# EasyEDA schematic SCH_TESIS_2025-09-22.json
TITLE: Sheet_1; REV: 1.0; Date: 2025-09-09; Sheet: 1/1; Drawn By: a20195821; Company: Your Company
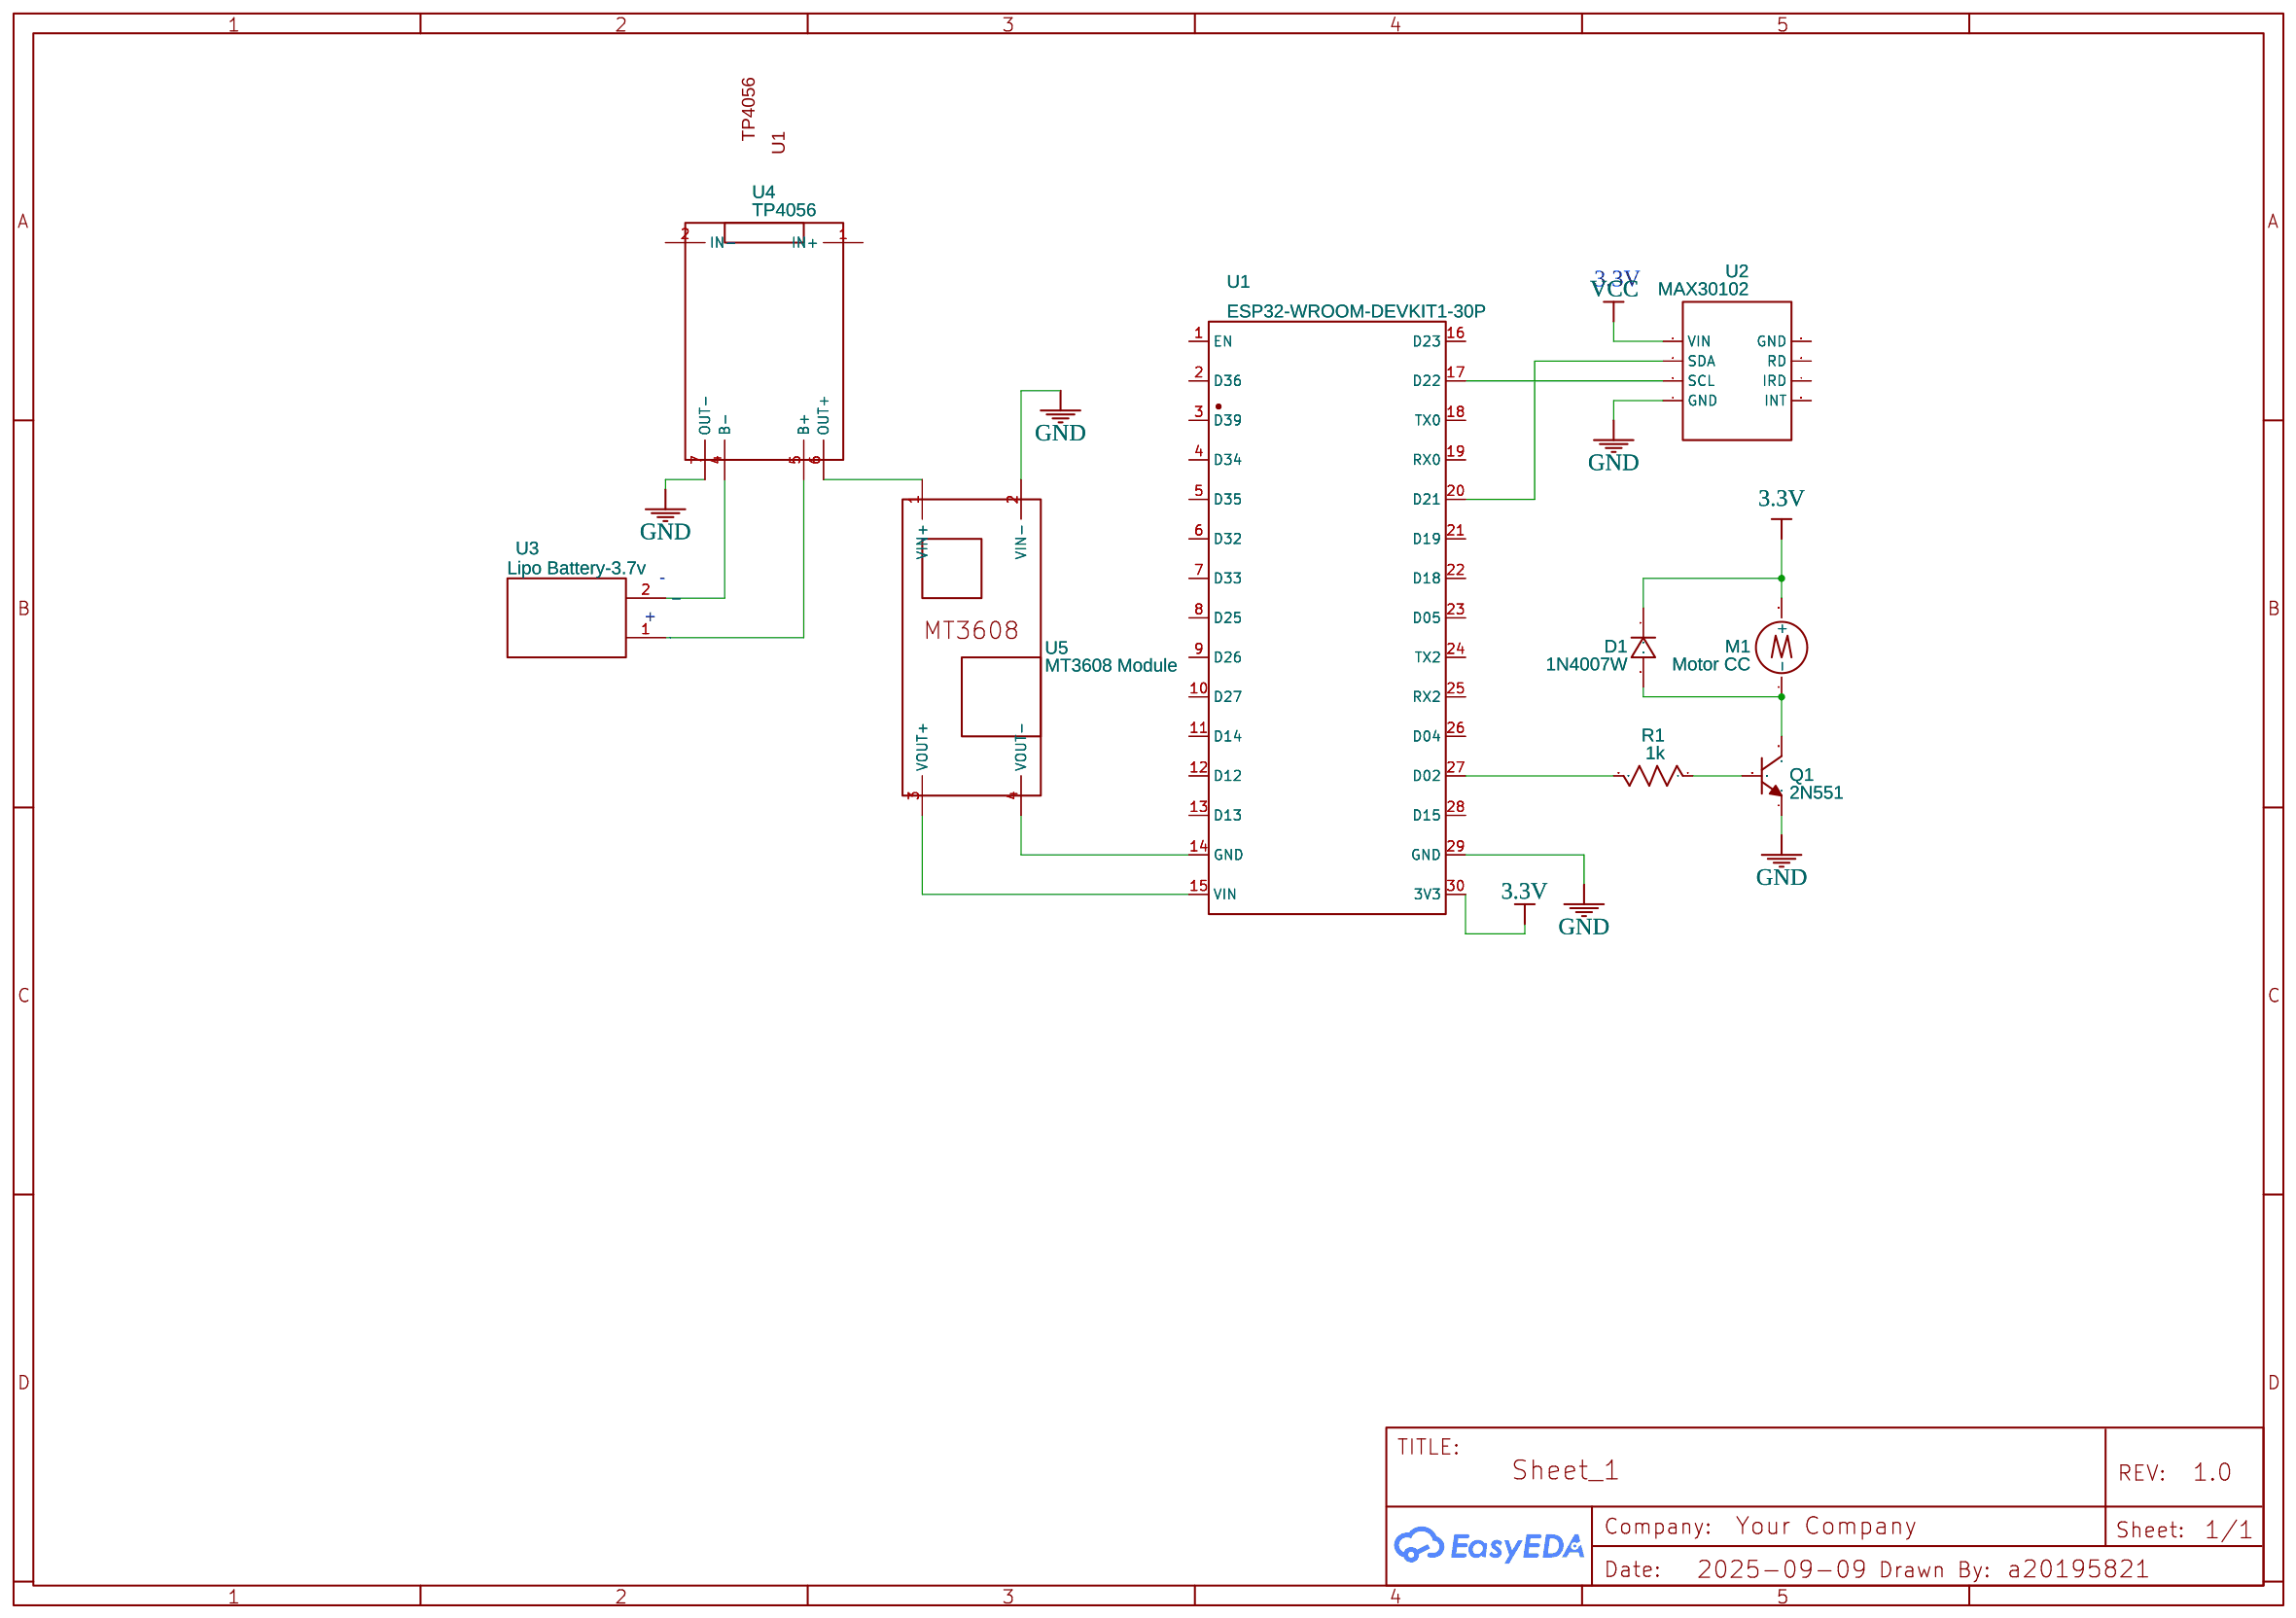
[diagram p0: schematic sheet]

## Parts
D1  1N4007W  [SOD-123_L2.8-W1.8-LS3.7-RD]
M1  Motor CC  [VIBRATION MOTOR - 3V COIN TYPE VIBRATION MOTOR 10000RPM]
Q1  2N551
R1  1k  [R0603]
U1  ESP32-WROOM-DEVKIT1-30P  [ESP32-WROOM-DEVKIT1-30P]
U2  MAX30102  [MAX30102]
U3  Lipo Battery-3.7v  [LIPO BATTERY-3.7V]
U4  TP4056  [TP4056]
U5  MT3608 Module  [MT3608]

## Library data of the parts
D1 = 1N4007W: Supplier: LCSC; Supplier Part: C328592; Manufacturer: BLUE ROCKET; Contributor: LCEDA_Lib
M1 = Motor CC: JLCPCB Part Class: Extended Part; Contributor: maria.p08
Q1 = 2N551: Contributor: apps1974z
R1 = R_0603_US: Contributor: LCEDA_Lib
U1 = ESP32-WROOM-DEVKIT1-30P: Contributor: viktor.g.stamenov
U2 = MAX30102: Contributor: ubayd2947
U3 = Lipo Battery-3.7v: Contributor: hirukasl6
U4 = TP4056: Contributor: puzrin.pavel
U5 = MT3608 Module: Supplier: Aliexpress; Contributor: Athantos

## Nets
3.3V: D1.1 M1.2(+) U1.30(3V3)
GND: Q1.E U1.29(GND) U2.4(GND) U4.7(OUT-) U5.2(VIN-)
VCC: U2.1(VIN)
Net-(D1-2): D1.2 M1.1(-) Q1.C
Net-(Q1-B): Q1.B R1.1
Net-(R1-2): R1.2 U1.27(D02)
Net-(U1-14): U1.14(GND) U5.4(VOUT-)
Net-(U1-15): U1.15(VIN) U5.3(VOUT+)
Net-(U1-17): U1.17(D22) U2.3(SCL)
Net-(U1-20): U1.20(D21) U2.2(SDA)
Net-(U4-6): U4.6(OUT+) U5.1(VIN+)

Not connected (* = marked no-connect by the designer): U1 1(EN) 2(D36) 3(D39) 4(D34) 5(D35) 6(D32) 7(D33) 8(D25) 9(D26) 10(D27) 11(D14) 12(D12) 13(D13) 16(D23) 18(TX0) 19(RX0) 21(D19) 22(D18) 23(D05) 24(TX2) 25(RX2) 26(D04) 28(D15); U2 5(GND) 6(RD) 7(IRD) 8(INT); U3 1(+) 2(-); U4 1(IN+) 2(IN-) 4(B-) 5(B+)

## Notes on the sheet
- 3.3V
- -
- +
